# Altium schematic sheet SSL-2020-MainBoard.SchDoc
size A4
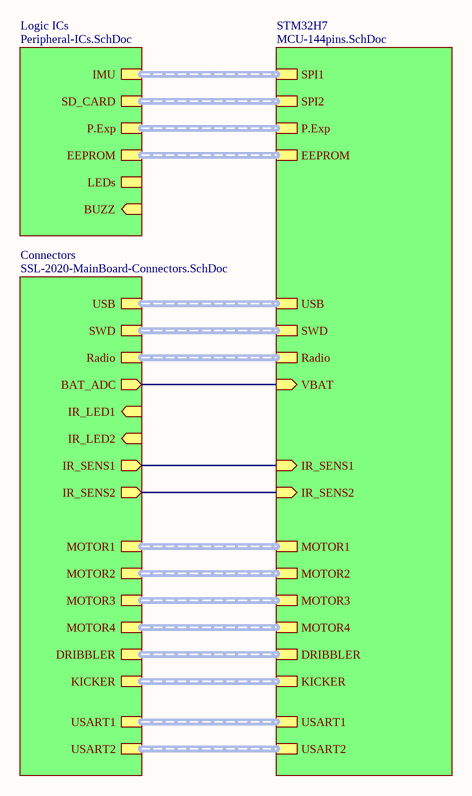
[diagram p0: SSL-2020-MainBoard.SchDoc]

## Sub-sheets
Connectors = SSL-2020-MainBoard-Connectors.SchDoc: USB (harness USB-4pins), SWD (harness SWD_4pin), Radio (harness SPI_Harness_6pins), BAT_ADC (out), IR_LED1 (in), IR_LED2 (in), IR_SENS1 (out), IR_SENS2 (out), MOTOR1 (harness MOTOR), MOTOR2 (harness MOTOR), MOTOR3 (harness MOTOR), MOTOR4 (harness MOTOR), DRIBBLER (harness DRIB_SIGNALS), KICKER (harness KICKER), USART1 (harness USART), USART2 (harness USART)
Logic ICs = Peripheral-ICs.SchDoc: IMU (harness SPI_Harness_5pins), SD_CARD (harness SPI_Harness_4pins), P.Exp (harness I2C_Harness_3pins), EEPROM (harness I2C_Harness_2pins), LEDs (harness LEDs), BUZZ (in)
STM32H7 = MCU-144pins.SchDoc: SPI1 (harness SPI_Harness_5pins), SPI2 (harness SPI2_SD-CARD), P.Exp (harness I2C_Harness_3pins), EEPROM (harness I2C_Harness_2pins), USB (harness USB), SWD (harness SWD), Radio (harness SPI3_RADIO), VBAT (in), IR_SENS1 (in), IR_SENS2 (in), MOTOR1 (harness MOTOR), MOTOR2 (harness MOTOR), MOTOR3 (harness MOTOR), MOTOR4 (harness MOTOR), DRIBBLER (harness DRIB_SIGNALS), KICKER (harness KICKER), USART1 (harness USART), USART2 (harness USART)

## Nets
(unnamed): sheet STM32H7/VBAT, sheet Connectors/BAT_ADC
(unnamed): sheet STM32H7/IR_SENS1, sheet Connectors/IR_SENS1
(unnamed): sheet STM32H7/IR_SENS2, sheet Connectors/IR_SENS2

## Buses and harness runs
harness sheet Connectors/DRIBBLER = sheet STM32H7/DRIBBLER
harness sheet Connectors/KICKER = sheet STM32H7/KICKER
harness sheet Connectors/MOTOR1 = sheet STM32H7/MOTOR1
harness sheet Connectors/MOTOR2 = sheet STM32H7/MOTOR2
harness sheet Connectors/MOTOR3 = sheet STM32H7/MOTOR3
harness sheet Connectors/MOTOR4 = sheet STM32H7/MOTOR4
harness sheet Connectors/Radio = sheet STM32H7/Radio
harness sheet Connectors/SWD = sheet STM32H7/SWD
harness sheet Connectors/USART1 = sheet STM32H7/USART1
harness sheet Connectors/USART2 = sheet STM32H7/USART2
harness sheet Connectors/USB = sheet STM32H7/USB
harness sheet Logic ICs/EEPROM = sheet STM32H7/EEPROM
harness sheet Logic ICs/IMU = sheet STM32H7/SPI1
harness sheet Logic ICs/P.Exp = sheet STM32H7/P.Exp
harness sheet Logic ICs/SD_CARD = sheet STM32H7/SPI2